# EAGLE design EC_Sensor (EAGLE 9.2.2)
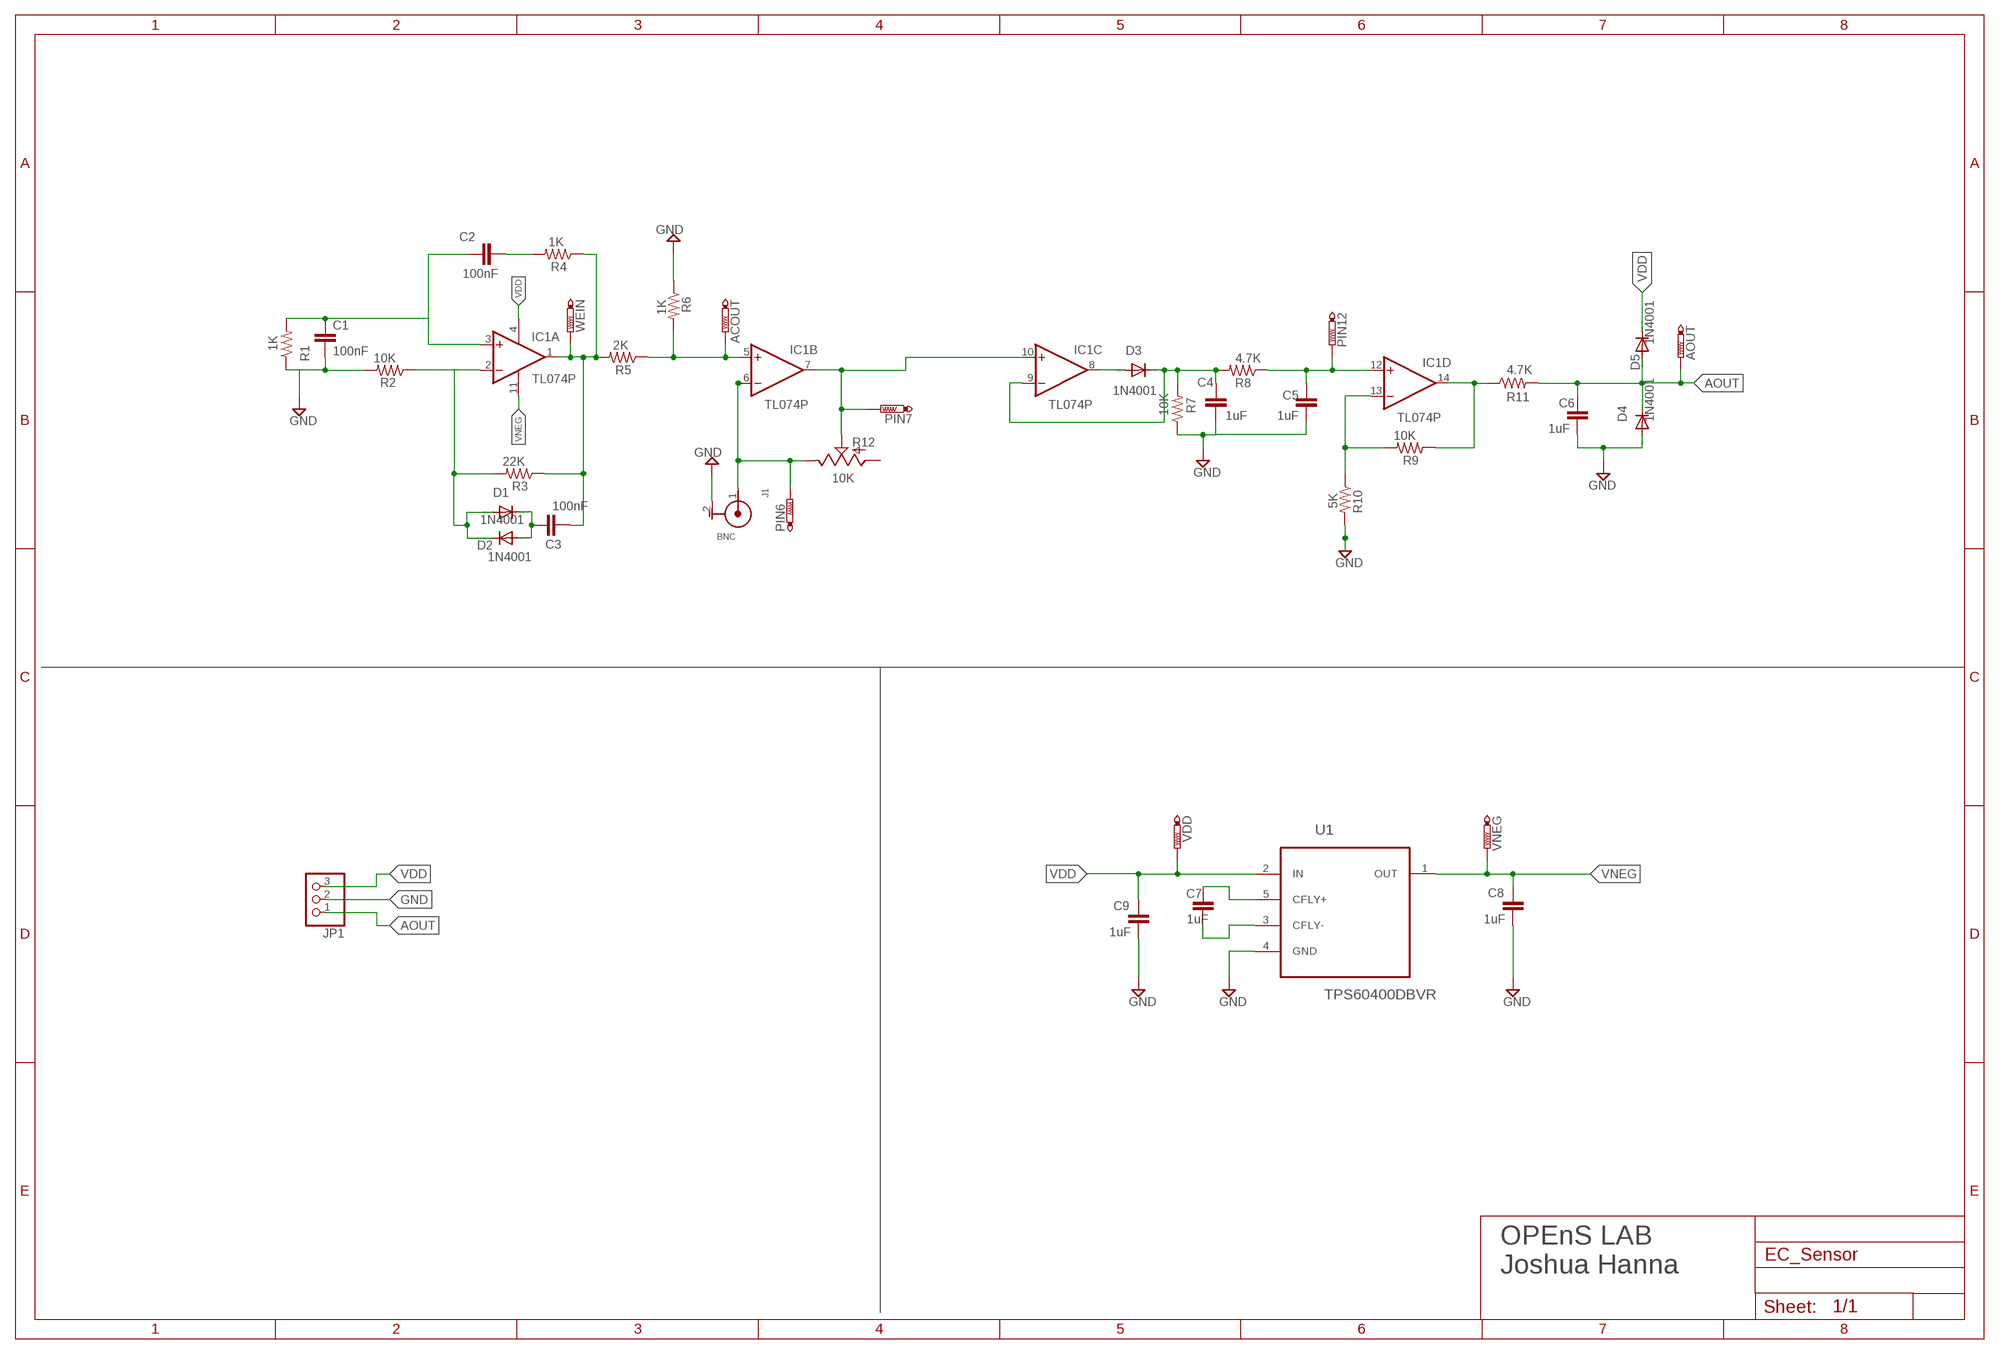
[diagram p0: schematic, sheet 1]

## Parts
ACOUT  PTR1PAD1-13  [P1-13]
AOUT  PTR1PAD1-13  [P1-13]
C1  100nF  C-EUC1206  [C1206]
C2  100nF  C-EUC1206  [C1206]
C3  100nF  C-EUC1206  [C1206]
C4  1uF  C-EUC1206  [C1206]
C5  1uF  C-EUC1206  [C1206]
C6  1uF  C-EUC1206  [C1206]
C7  1uF  C-EUC1206  [C1206]
C8  1uF  C-EUC1206  [C1206]
C9  1uF  C-EUC1206  [C1206]
D1  1N4001  DIODE-D-5  [D-5]
D2  1N4001  DIODE-D-5  [D-5]
D3  1N4001  DIODE-D-5  [D-5]
D4  1N4001  DIODE-D-5  [D-5]
D5  1N4001  DIODE-D-5  [D-5]
IC1  TL074P  [DIL14]
J1  BNC  227161-1  [TE_227161-1]
JP1  PINHD-1X3  [1X03]
PIN6  PTR1PAD1-13  [P1-13]
PIN7  PTR1PAD1-13  [P1-13]
PIN12  PTR1PAD1-13  [P1-13]
R1  1K  R-US_R1206  [R1206]
R2  10K  R-US_R1206  [R1206]
R3  22K  R-US_R1206  [R1206]
R4  1K  R-US_R1206  [R1206]
R5  2K  R-US_R1206  [R1206]
R6  1K  R-US_R1206  [R1206]
R7  10K  R-US_R1206  [R1206]
R8  4.7K  R-US_R1206  [R1206]
R9  10K  R-US_R1206  [R1206]
R10  5K  R-US_R1206  [R1206]
R11  4.7K  R-US_R1206  [R1206]
R12  10K  TRIM_US-B64Y  [B64Y]
U1  TPS60400DBVR  [SOT95P280X145-5N]
VDD  PTR1PAD1-13  [P1-13]
VNEG  PTR1PAD1-13  [P1-13]
WEIN  PTR1PAD1-13  [P1-13]

## Nets
AOUT: AOUT.TP C6.2 D4.C D5.A JP1.1 R11.2
GND: C1.2 C4.1 C5.1 C6.1 C8.1 C9.1 D4.A J1.2(G) JP1.2 R1.1 R2.2 R6.1 R7.1 R10.2 U1.4(GND)
N$1: C1.1 C2.1 IC1.3(A:+IN) R1.2
N$2: C2.2 R4.2
N$3: C3.2 IC1.1(A:OUT) R3.1 R4.1 R5.2 WEIN.TP
N$4: D1.A D2.C IC1.2(A:-IN) R2.1 R3.2
N$5: ACOUT.TP IC1.5(B:+IN) R5.1 R6.2
N$6: IC1.6(B:-IN) J1.1(C) PIN6.TP R12.E
N$8: C7.2 U1.5(CFLY+)
N$9: C3.1 D1.C D2.A
N$12: C4.2 D3.C IC1.9(C:-IN) R7.2 R8.2
N$13: D3.A IC1.8(C:OUT)
N$14: C7.1 U1.3(CFLY-)
N$15: C5.2 IC1.12(D:+IN) PIN12.TP R8.1
N$16: IC1.13(D:-IN) R9.2 R10.1
N$18: IC1.14(D:OUT) R9.1 R11.1
PIN7: IC1.7(B:OUT) IC1.10(C:+IN) PIN7.TP R12.S
VDD: C9.2 D5.C IC1.4(P:V+) JP1.3 U1.2(IN) VDD.TP
VNEG: C8.2 IC1.11(P:V-) U1.1(OUT) VNEG.TP
Unconnected: R12.A

## Notes on the sheet
- OPEnS LAB
  Joshua Hanna

## Library data of the parts
ACOUT AOUT PIN6 PIN7 PIN12 VDD VNEG WEIN = testpad:PTR1: TEST PIN
C1-C9 = rcl:C-EU: CAPACITOR, European symbol; SPICEPREFIX: C
D1-D5 = diode:DIODE-: DIODE
IC1 = linear:TL074: OP AMP
J1 = 227161-1:227161-1: CONN BNC JACK R/A 50 OHM PCB; AVAILABILITY: Unavailable; COMMENT: 227161-1; DESCRIPTION: BNC Series 50 Ohm Right Angle Through Hole Jack Female Socket Connector; EU_ROHS_COMPLIANCE: Compliant with Exemptions; MF: TE Connectivity; MP: 227161-1; NUMBER_OF_POSITIONS: 1; PACKAGE: None; PRICE: None; TE_PURCHASE_URL: https://www.te.com/usa-en/product-227161-1.html?te_bu=Cor&te_type=disp&te_campaign=seda_glo_cor-seda-global-disp-prtnr-fy19-seda-model-bom-cta_sma-317_1&elqCampaignId=32493
JP1 = pinhead:PINHD-1X3: PIN HEADER
R1-R11 = rcl:R-US_: RESISTOR, American symbol; SPICEPREFIX: R
R12 = pot:TRIM_US-: POTENTIOMETER
U1 = TPS60400DBVR:TPS60400DBVR: Unregulated 60mA charge pump Voltage Inverter; AVAILABILITY: Unavailable; DESCRIPTION: 60mA Charge Pump Voltage Inverter with Variable Switching Frequency 5-SOT-23 -40 to 85; MF: Texas Instruments; MP: TPS60400DBVR; PACKAGE: SOT-23-5 Texas Instruments; PRICE: None

## Board
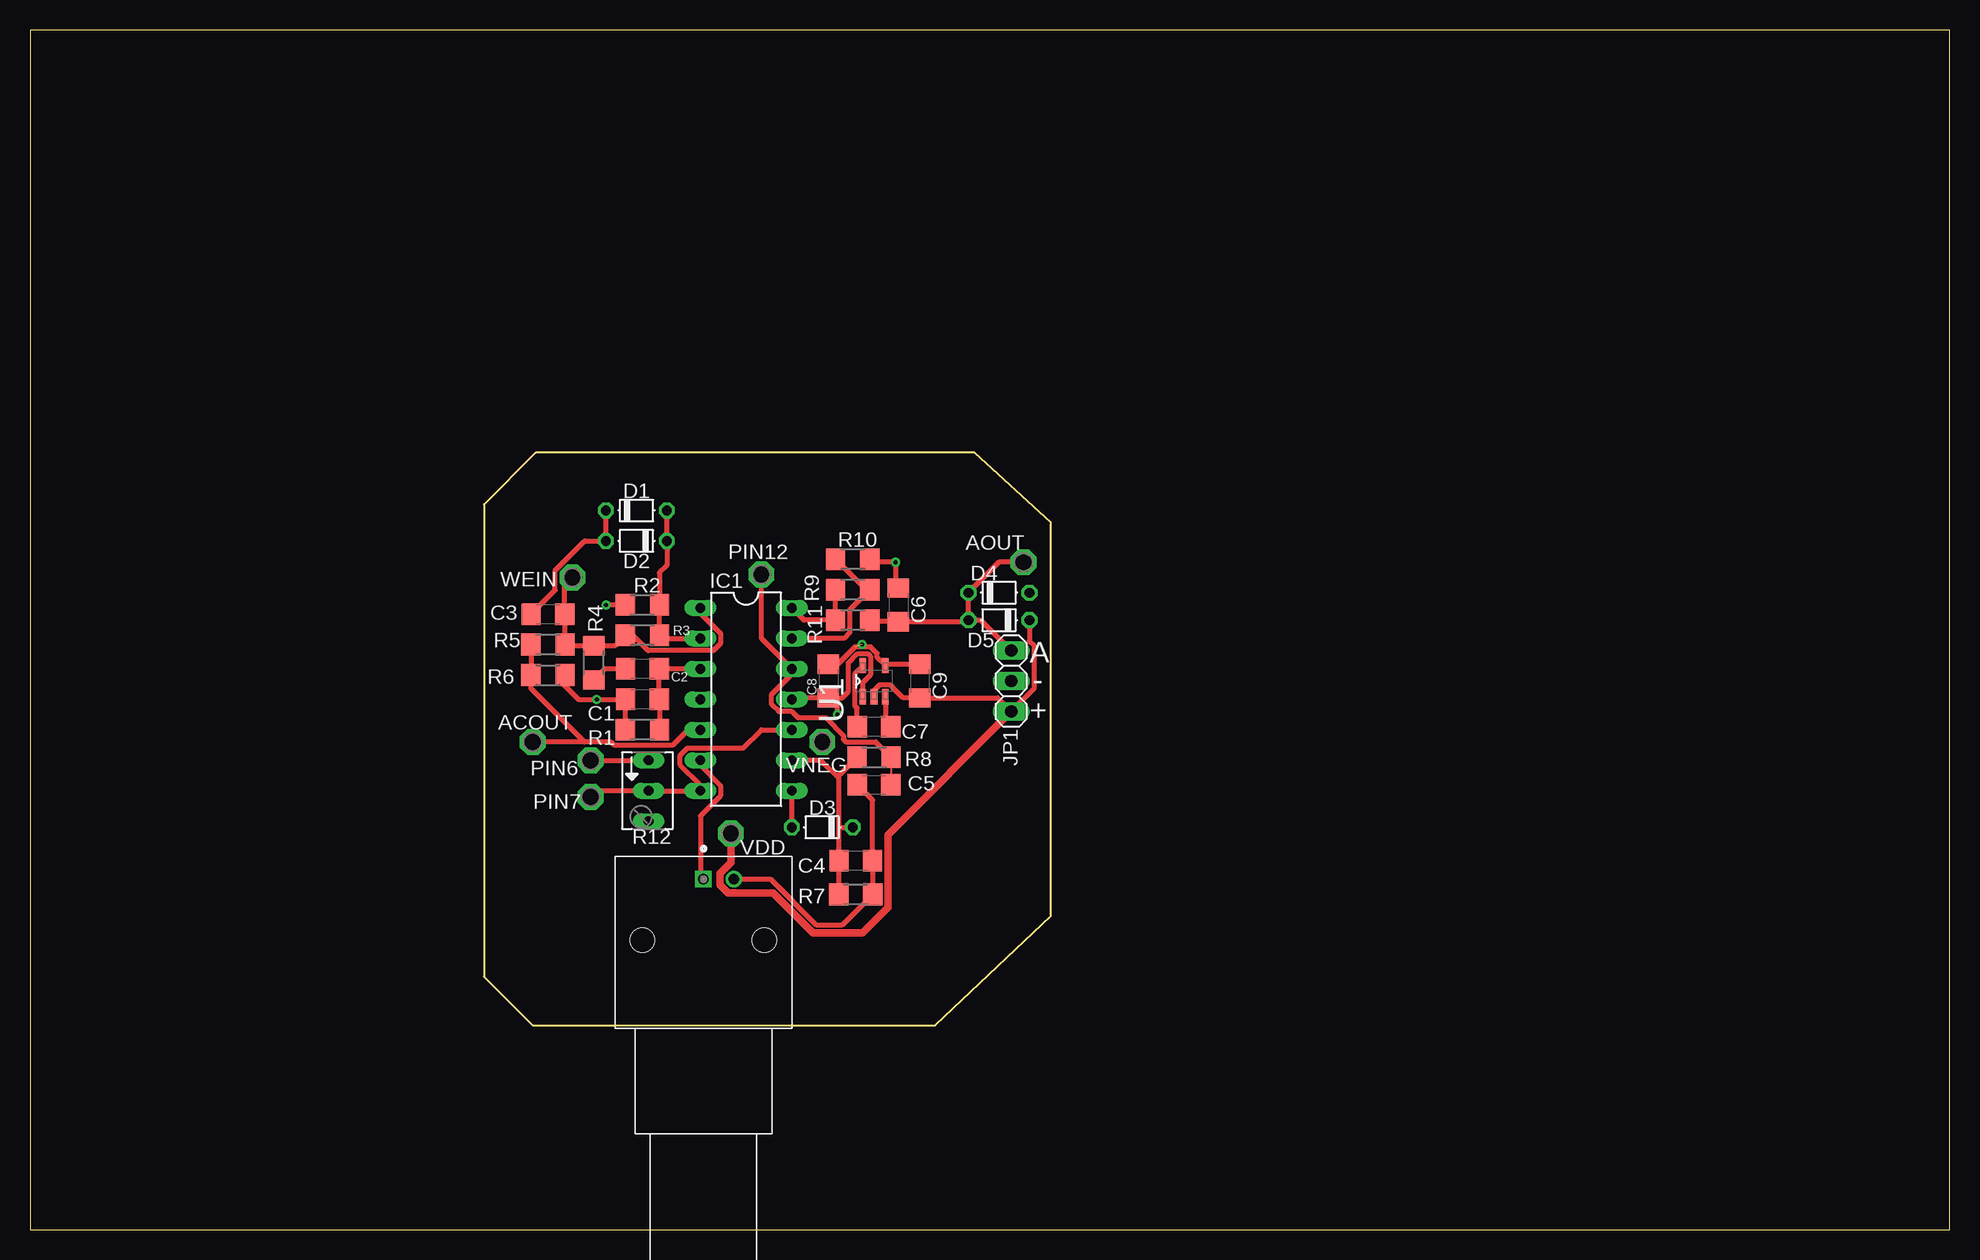
[diagram p1: board, top side]
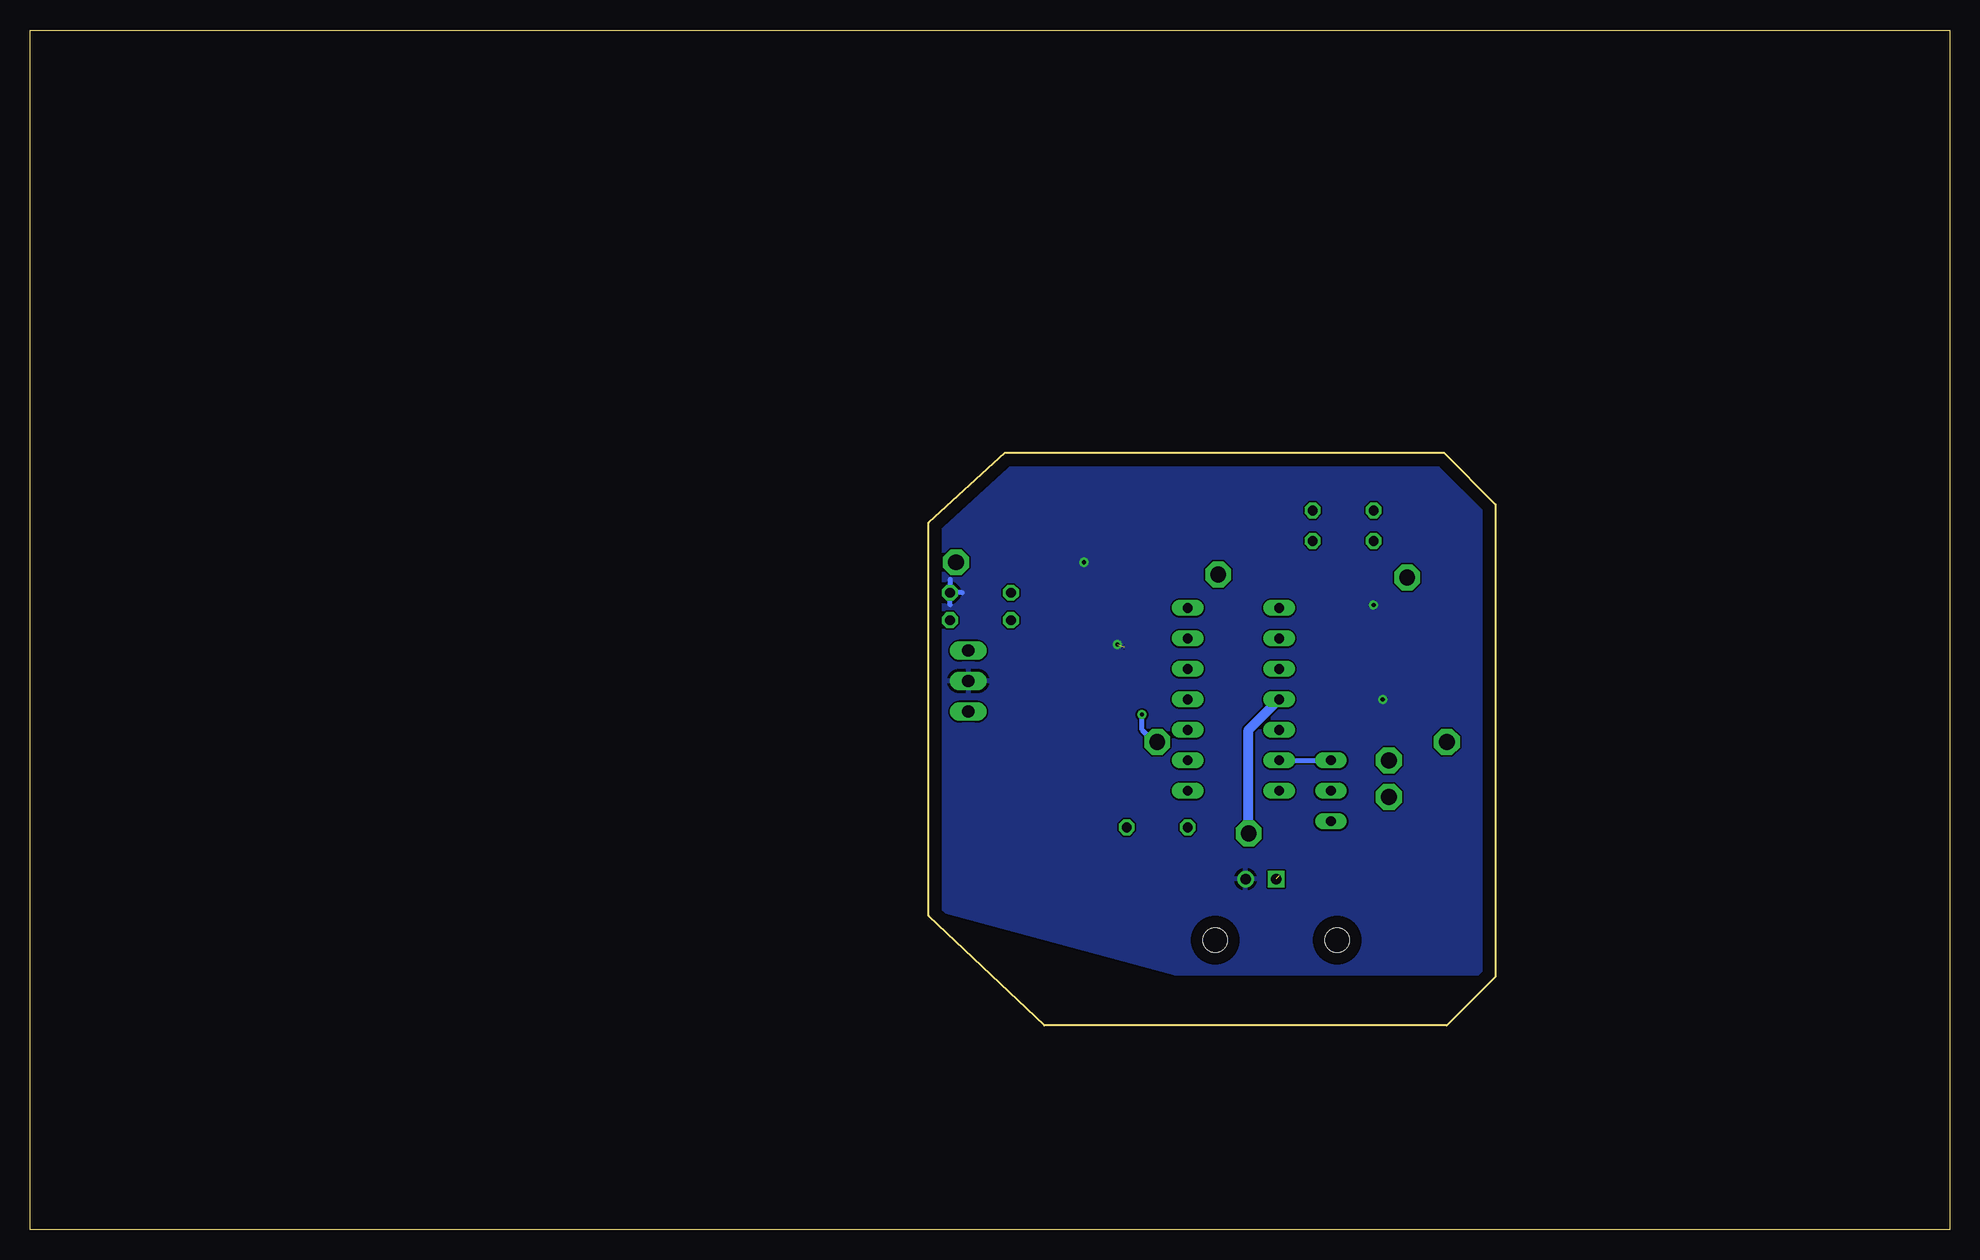
[diagram p2: board, bottom side, seen from below]

Size 160 x 100 mm. Coordinates in mm from the lower left corner, seen from the top.
Outline: 0,0 160,0 160,100 0,100 0,0
Outline: 41.91,17.02 75.44,17.02 85.09,26.16 85.09,58.93 78.74,64.77 42.16,64.77 37.85,60.45 37.85,21.08 41.91,17.02
Copper layers (1*16): Top 0.035mm / dielectric 1.5mm / Bottom 0.035mm
Design rules "default": minimum track width 6mil, minimum drill 0.35mm, track to track 6mil, track to pad 6mil, pad to pad 6mil, via to via 6mil, smd to smd 6mil, copper to edge 40mil, drill to drill 6mil, minimum pad ring 10mil, minimum via ring 8mil, stop-mask expansion 4mil, vias tented up to drill 0mil, thermal gap 10mil

### Footprints (pad centres in the part's own frame; a part is rotated, then mirrored left to right if it is on the bottom)
P1-13 = drill 1.321 pad 2.159 octagon: TP 0,0
C1206 = smd 1.6 x 1.8: 1 -1.4,0; 2 1.4,0
D-5 = drill 0.813 octagon: A 2.54,0; C -2.54,0
DIL14 = drill 0.813 long: 1 -7.62,-3.81; 2 -5.08,-3.81; 3 -2.54,-3.81; 4 0,-3.81; 5 2.54,-3.81; 6 5.08,-3.81; 7 7.62,-3.81; 8 7.62,3.81; 9 5.08,3.81; 10 2.54,3.81; 11 0,3.81; 12 -2.54,3.81; 13 -5.08,3.81; 14 -7.62,3.81
TE_227161-1 = drill 0.89 square: 1 0,0 | drill 0.89: 2 -2.54,0 | hole 2.01: -5.08,5.08; 5.08,5.08
1X03 = drill 1.016 long: 1 -2.54,0; 2 0,0; 3 2.54,0
R1206 = smd 1.6 x 1.803: 1 -1.422,0; 2 1.422,0
B64Y = drill 0.813 long: A 2.54,0; E -2.54,0; S 0,0
SOT95P280X145-5N = smd 1.27 x 0.559: 1 -1.295,0.94; 2 -1.295,0; 3 -1.295,-0.94; 4 1.295,-0.94; 5 1.295,0.94

### Placement (x,y rotation side)
ACOUT  41.91,40.64 180 top
AOUT  82.8,55.63 0 top
C1  51.05,44.2 180 top
C2  51.05,46.74 180 top
C3  43.18,51.31 0 top
C4  68.83,30.73 180 top
C5  70.36,37.08 0 top
C6  72.39,52.07 270 top
C7  70.36,41.91 180 top
C8  66.55,45.72 270 top
C9  74.17,45.72 270 top
D1  50.55,59.94 0 top
D2  50.55,57.4 180 top
D3  66.04,33.53 180 top
D4  80.77,53.09 0 top
D5  80.77,50.8 180 top
IC1  59.69,44.2 270 top
J1  56.13,29.21 180 top
JP1  81.79,45.72 270 top
PIN6  46.74,39.12 180 top
PIN7  46.74,36.07 0 top
PIN12  60.96,54.61 0 top
R1  51.05,41.66 0 top
R2  51.05,52.07 180 top
R3  51.05,49.53 0 top
R4  46.99,47.24 270 top
R5  43.18,48.77 0 top
R6  43.18,46.23 180 top
R7  68.83,27.94 180 top
R8  70.36,39.37 180 top
R9  68.58,53.34 0 top
R10  68.58,55.88 0 top
R11  68.58,50.8 0 top
R12  51.56,36.58 270 top
U1  70.36,45.72 90 top
VDD  58.42,33.02 0 top
VNEG  66.04,40.64 0 top
WEIN  45.21,54.36 180 top

### Tracks (layer width: path | path; a pad name or v marks a point on that pad's centre or on a via)
AOUT
  Top 0.406: D5.A D4.C 80.77,55.63 AOUT.TP | D5.A 78.1,50.67 C6.2 70.13,50.67 R11.2 | D5.A 79.25,50.8 JP1.1
GND  (via drill 0.35)  (1 unrouted)
  Top 0.152: 70.26,30.63 C4.1 70.1,30.79 | 70.26,28.04 R7.1 70.1,27.89 69.49,27.89 | 69.04,37.03 C5.1 | 74.07,47.09 C9.1 74.22,47.09 | 67.51,47.24 66.6,47.24 C8.1 66.45,47.09 65.84,47.09 | 58.67,29.11 J1.2 | 49.68,44.2 C1.2 | 49.68,41.76 R1.1 | 44.65,46.18 R6.1 44.5,46.33 44.5,46.79 | 72.39,53.49 C6.1 | 70.1,55.78 R10.2 69.95,55.93 | 49.68,52.12 R2.2 | 71.48,47.09 71.32,47.09 U1.4 71.48,47.09
  Top 0.406: J1.2 61.72,29.21 65.53,25.4 67.72,25.4 R7.1 70.26,30.63 | 70.26,30.63 | C4.1 70.23,35.81 C5.1 | R1.1 49.63,44.15 | 49.63,44.15 49.68,44.2 | R6.1 44.6,45.62 44.45,45.47 45.72,44.2 v47.24,44.2 49.58,44.2 49.63,44.15 | C9.1 71.4,47.12 U1.4 70.61,47.7 70.61,48.03 70.08,48.56 68.76,48.56 67.21,47.02 66.65,47.02 C8.1 | R2.2 v48.01,52.07 | R10.2 70.26,55.63 v72.14,55.63 72.14,53.75 72.39,53.49
  Bottom 0.406: 83.31,54.19 D4.A | 82.3,53.09 D4.A | 83.31,52.07 D4.A | 83.8,53.09 D4.A
  other vias: 69.34,48.77
  pour Bottom: 84.33,26.67 84.33,57.91 78.49,63.75 42.42,63.75 38.86,60.2 38.86,21.34 64.52,21.34
N$1
  Top 0.406: IC1.3 C2.1 C1.1 52.48,44.17 R1.2
N$2
  Top 0.406: C2.2 47.9,46.74 R4.2
N$3
  Top 0.406: IC1.1 55.88,51.37 57.56,49.7 57.56,48.85 56.96,48.26 51.54,48.26 50.27,49.53 R3.1 48.77,48.67 R4.1 44.7,48.67 R5.2 44.6,51.29 C3.2 44.58,53.72 WEIN.TP
N$4
  Top 0.406: D1.A D2.C 53.09,55.37 52.48,54.76 R2.1 R3.2 52.73,49.28 IC1.2
N$5
  Top 0.406: R5.1 R6.2 41.76,45.11 46.23,40.64 | 46.23,40.64 48.44,40.64 48.69,40.4 53.61,40.4 54.86,41.66 IC1.5 | 46.23,40.64 ACOUT.TP
N$6  (1 unrouted)
  Top 0.406: PIN6.TP R12.E | IC1.6 55.88,38.67 57.56,37 57.56,36.16 55.88,34.48 55.88,29.46
  Bottom 0.406: IC1.6 R12.E
N$8
  Top 0.406: C7.2 68.96,43.47 68.78,43.64 68.78,46.38 U1.5
N$9
  Top 0.406: D1.C D2.A 46.23,57.4 43.78,54.95 43.78,53.3 C3.1
N$12
  Top 0.406: R7.2 67.43,27.96 C4.2 67.43,33.53 | 67.43,33.53 67.43,37.59 | 67.43,37.59 67.43,37.87 R8.2 | 67.43,33.53 D3.C | 67.43,37.59 65.91,39.12 IC1.9
N$13
  Top 0.152: 63.55,33.53 D3.A | 63.55,36.58 IC1.8
  Top 0.406: D3.A 63.5,36.52 63.55,36.58
N$14
  Top 0.406: U1.3 71.3,42.37 C7.1
N$15
  Top 0.152: C5.2 71.78,37.19 71.78,39.32 R8.1 71.63,39.47
  Top 0.406: PIN12.TP 60.96,49.28 IC1.12 63.5,46.29 61.82,44.62 61.82,43.77 62.42,43.18 63.5,43.18 64.01,42.67 66.29,42.67 67.8,41.16 67.8,40.86 68.01,40.65 70.5,40.65 R8.1
N$16
  Top 0.406: R10.1 69.7,53.34 R9.2 68.31,51.65 68.31,49.75 67.84,49.28 IC1.13
N$18
  Top 0.406: IC1.14 64.52,50.8 R11.1 R9.1
PIN7
  Top 0.406: PIN7.TP 47.24,36.58 R12.S IC1.7 55.88,37.02 54.2,38.7 54.2,39.54 54.8,40.13 59.44,40.13 60.96,41.66 IC1.10
VDD
  Top 0.152: 70.26,44.35 U1.2
  Top 0.406: U1.2 70.36,44.96 70.81,45.41 71.72,45.41 71.93,45.21 71.93,45.16 72.77,44.32 C9.2 80.65,44.32 JP1.3 83.67,45.06 83.67,48.72 83.31,49.08 D5.C
  Top 0.61: VDD.TP 58.42,30.59 57.52,29.69 57.52,28.73 58.2,28.05 61.94,28.05 65.26,24.74 69.4,24.74 71.51,26.85 71.51,32.91 JP1.3
  Bottom 0.2: 58.37,33.07 VDD.TP
  Bottom 0.813: VDD.TP 58.42,41.66 IC1.4
VNEG  (via drill 0.35)
  Top 0.406: C8.2 67.69,44.32 68.22,44.86 68.22,47.24 68.99,48.01 69.84,48.01 70.05,47.8 70.05,46.23 69.39,45.57 69.39,44.45 U1.1 | C8.2 63.62,44.32 IC1.11 | C8.2 66.29,44.07 | v67.31,42.93 67.31,43.56 C8.2
  Bottom 0.406: VNEG.TP 66.29,40.64 67.31,41.66 v67.31,42.93

### Text on the board
tNames: A | - | +